# EAGLE design Sensor tile (EAGLE 6.6.0)
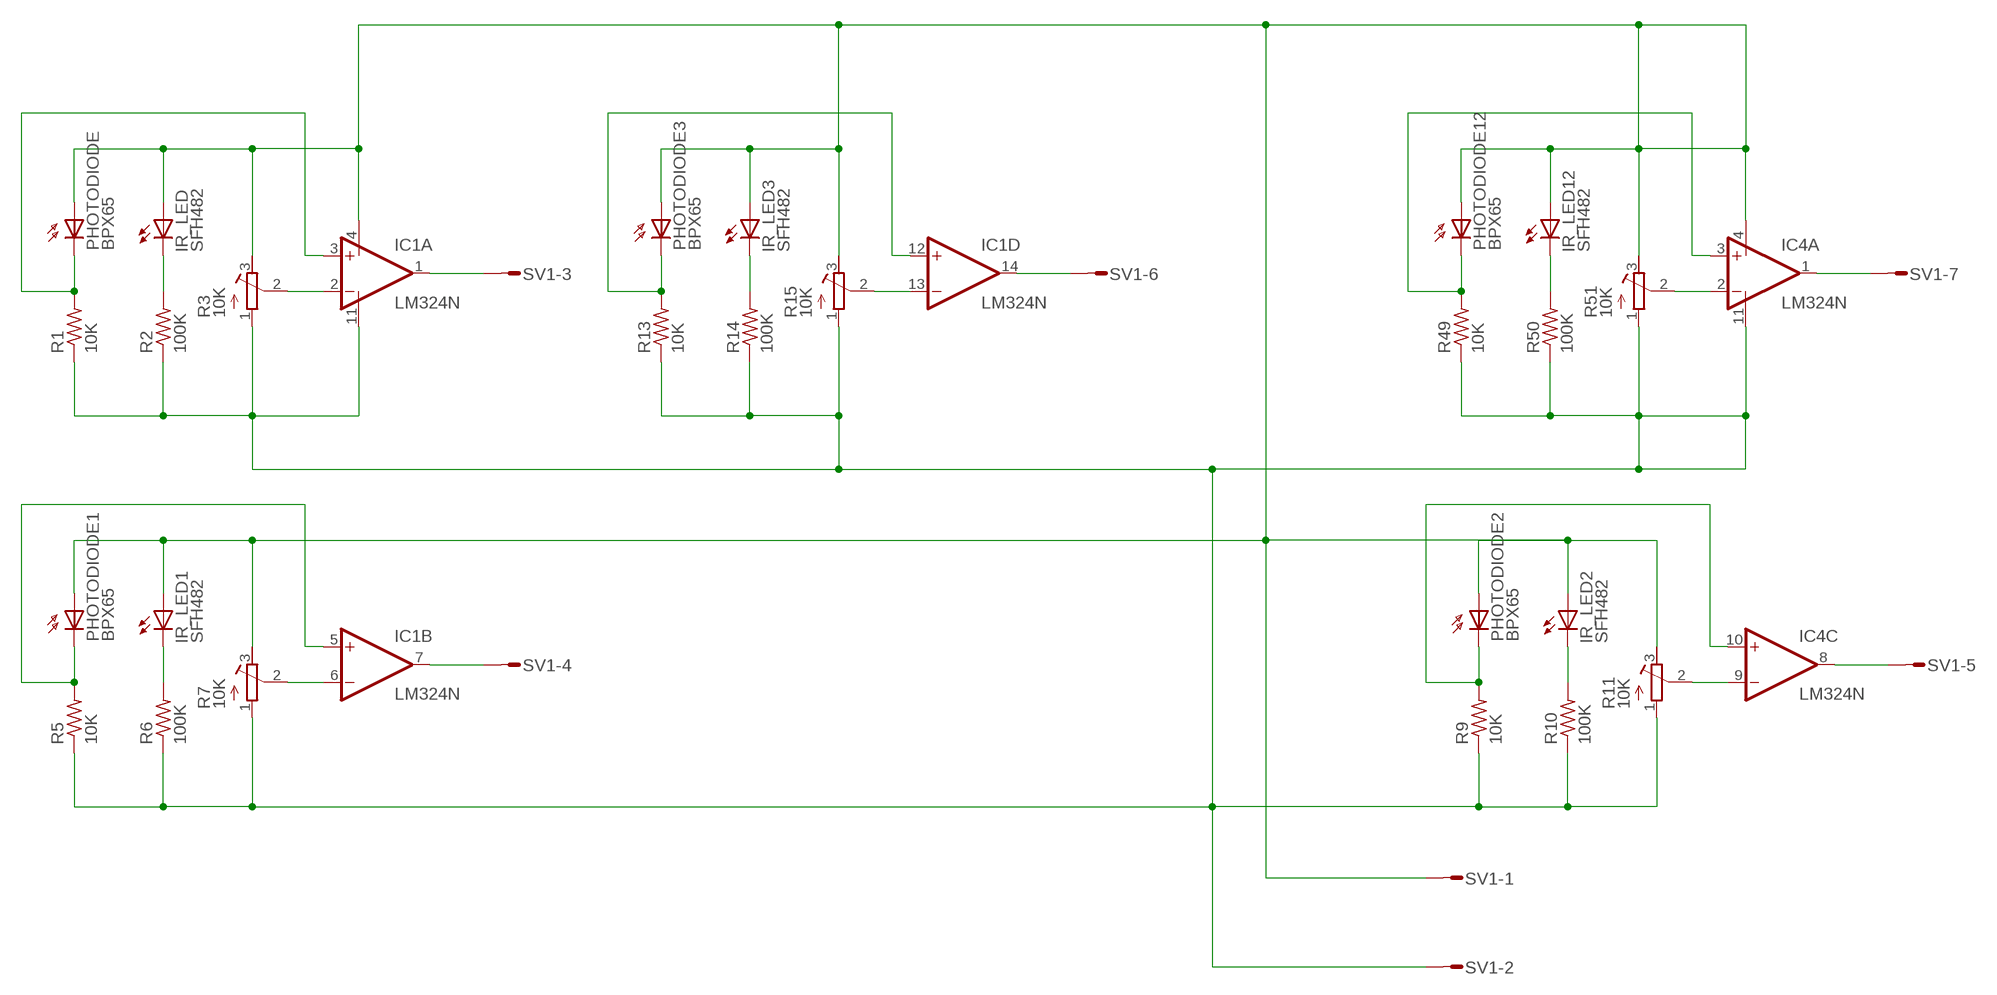
[diagram p0: schematic, sheet 1]

## Parts
IC1  LM324N  [DIL14]
IC4  LM324N  [DIL14]
IR_LED  SFH482  [SFH482]
IR_LED1  SFH482  [SFH482]
IR_LED2  SFH482  [SFH482]
IR_LED3  SFH482  [SFH482]
IR_LED12  SFH482  [SFH482]
PHOTODIODE  BPX65  [BPX65]
PHOTODIODE1  BPX65  [BPX65]
PHOTODIODE2  BPX65  [BPX65]
PHOTODIODE3  BPX65  [BPX65]
PHOTODIODE12  BPX65  [BPX65]
R1  10K  R-US_0204/7  [0204/7]
R2  100K  R-US_0204/7  [0204/7]
R3  10K  R-TRIMM4G/J  [RTRIM4G/J]
R5  10K  R-US_0204/7  [0204/7]
R6  100K  R-US_0204/7  [0204/7]
R7  10K  R-TRIMM4G/J  [RTRIM4G/J]
R9  10K  R-US_0204/7  [0204/7]
R10  100K  R-US_0204/7  [0204/7]
R11  10K  R-TRIMM4G/J  [RTRIM4G/J]
R13  10K  R-US_0204/7  [0204/7]
R14  100K  R-US_0204/7  [0204/7]
R15  10K  R-TRIMM4G/J  [RTRIM4G/J]
R49  10K  R-US_0204/7  [0204/7]
R50  100K  R-US_0204/7  [0204/7]
R51  10K  R-TRIMM4G/J  [RTRIM4G/J]
SV1  L07P  [L07P]

## Nets
N$2: IC1.3(A:+IN) PHOTODIODE.K(C) R1.2
N$3: IR_LED.K(C) R2.2
N$5: IC1.2(A:-IN) R3.2(S)
N$6: IC1.1(A:OUT) SV1.3
N$9: IC1.5(B:+IN) PHOTODIODE1.K(C) R5.2
N$10: IR_LED1.K(C) R6.2
N$12: IC1.6(B:-IN) R7.2(S)
N$14: IC1.7(B:OUT) SV1.4
N$15: IC1.4(P:V+) IC4.4(P:V+) IR_LED1.A IR_LED2.A IR_LED3.A IR_LED12.A IR_LED.A PHOTODIODE1.A PHOTODIODE2.A PHOTODIODE3.A PHOTODIODE12.A PHOTODIODE.A R3.3(E) R7.3(E) R11.3(E) R15.3(E) R51.3(E) SV1.1
N$16: IC4.10(C:+IN) PHOTODIODE2.K(C) R9.2
N$17: IR_LED2.K(C) R10.2
N$18: IC1.11(P:V-) IC4.11(P:V-) R1.1 R2.1 R3.1(A) R5.1 R6.1 R7.1(A) R9.1 R10.1 R11.1(A) R13.1 R14.1 R15.1(A) R49.1 R50.1 R51.1(A) SV1.2
N$19: IC4.9(C:-IN) R11.2(S)
N$21: IC4.8(C:OUT) SV1.5
N$23: IC1.12(D:+IN) PHOTODIODE3.K(C) R13.2
N$24: IR_LED3.K(C) R14.2
N$26: IC1.13(D:-IN) R15.2(S)
N$28: IC1.14(D:OUT) SV1.6
N$57: IC4.3(A:+IN) PHOTODIODE12.K(C) R49.2
N$60: IR_LED12.K(C) R50.2
N$85: IC4.2(A:-IN) R51.2(S)
N$87: IC4.1(A:OUT) SV1.7
Unconnected: IC1.8(C:OUT) IC1.9(C:-IN) IC1.10(C:+IN) IC4.5(B:+IN) IC4.6(B:-IN) IC4.7(B:OUT) IC4.12(D:+IN) IC4.13(D:-IN) IC4.14(D:OUT)

## Library data of the parts
IC1 IC4 = linear:LM324: OP AMP
IR_LED IR_LED1-IR_LED3 IR_LED12 = led:SFH482: IR LED infrared emitting diode, Infineon
PHOTODIODE PHOTODIODE1-PHOTODIODE3 PHOTODIODE12 = opto-trans-siemens:BPX65: PHOTO DIODE; MPN: BPX65.; OC_FARNELL: 327451; OC_NEWARK: 06WX2764
R1 R2 R5 R6 R9 R10 R13 R14 R49 R50 = rcl:R-US_: RESISTOR, American symbol
R3 R7 R11 R15 R51 = rcl:R-TRIMM: Trimm resistor
SV1 = con-amp-mt:L07P: AMP MT CONNECTOR; OC_FARNELL: unknown; OC_NEWARK: unknown

## Net classes
0 default: clearance 0.205 mm

## Board
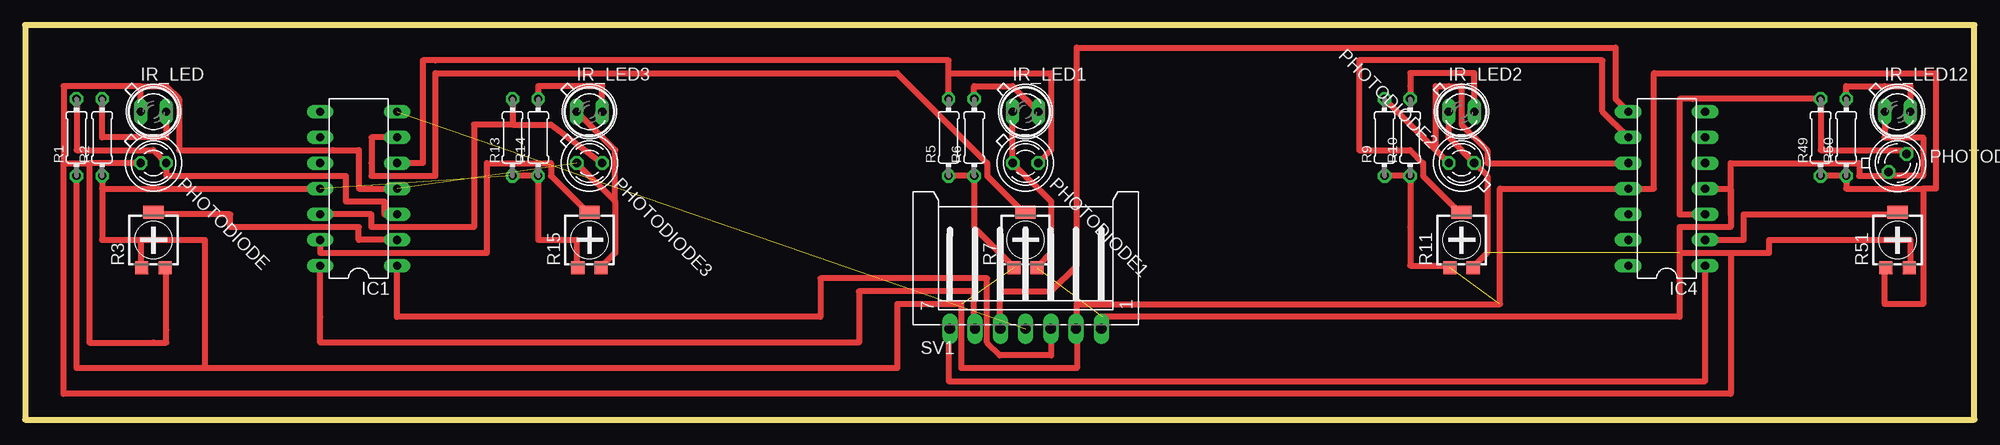
[diagram p1: board, top side]

Size 193.02 x 39.04 mm. Coordinates in mm from the lower left corner, seen from the top.
Outline: 0,0 193.02,0 193.02,39.04 0,39.04 0,0
Copper layers (1*16): Top 0.035mm / dielectric 1.5mm / Bottom 0.035mm
Design rules "default": minimum track width 10mil, minimum drill 24mil, track to track 8mil, track to pad 8mil, pad to pad 8mil, via to via 8mil, smd to smd 8mil, copper to edge 40mil, drill to drill 8mil, minimum pad ring 10mil, minimum via ring 8mil, stop-mask expansion 4mil, vias tented up to drill 0mil, thermal gap 10mil

### Footprints (pad centres in the part's own frame; a part is rotated, then mirrored left to right if it is on the bottom)
DIL14 = drill 0.813 long: 1 -7.62,-3.81; 2 -5.08,-3.81; 3 -2.54,-3.81; 4 0,-3.81; 5 2.54,-3.81; 6 5.08,-3.81; 7 7.62,-3.81; 8 7.62,3.81; 9 5.08,3.81; 10 2.54,3.81; 11 0,3.81; 12 -2.54,3.81; 13 -5.08,3.81; 14 -7.62,3.81
SFH482 = drill 0.813 long: A -1.27,0; K 1.27,0
BPX65 = drill 0.813 octagon: A -0.889,-0.889; K 0.889,0.889
0204/7 = drill 0.813 octagon: 1 -3.81,0; 2 3.81,0
RTRIM4G/J = smd 1.3 x 1.3: 1 -1.15,-2.75; 3 1.15,-2.75 | smd 2 x 1.3: 2 0,2.75
L07P = drill 1.016 long: 1 7.5,-6.25; 2 5,-6.25; 3 2.5,-6.25; 4 0,-6.25; 5 -2.5,-6.25; 6 -5,-6.25; 7 -7.5,-6.25

### Placement (x,y rotation side)
IC1  33.02,22.86 90 top
IC4  162.56,22.86 90 top
IR_LED  12.7,30.48 0 top
IR_LED1  99.06,30.48 0 top
IR_LED2  142.24,30.48 0 top
IR_LED3  55.88,30.48 0 top
IR_LED12  185.42,30.48 0 top
PHOTODIODE  12.7,25.4 315 top
PHOTODIODE1  99.06,25.4 315 top
PHOTODIODE2  142.24,25.4 135 top
PHOTODIODE3  55.88,25.4 315 top
PHOTODIODE12  185.42,25.4 0 top
R1  5.08,27.94 90 top
R2  7.62,27.94 90 top
R3  12.7,17.78 0 top
R5  91.44,27.94 90 top
R6  93.98,27.94 90 top
R7  99.06,17.78 0 top
R9  134.62,27.94 90 top
R10  137.16,27.94 90 top
R11  142.24,17.78 0 top
R13  48.26,27.94 90 top
R14  50.8,27.94 90 top
R15  55.88,17.78 0 top
R49  177.8,27.94 90 top
R50  180.34,27.94 90 top
R51  185.42,17.78 0 top
SV1  99.06,15.24 0 top

### Tracks (layer width: path | path; a pad name or v marks a point on that pad's centre or on a via)
N$2
  Top 0.61: PHOTODIODE.K 12.7,26.67 5.08,26.67 R1.2 | IC1.3 35.56,20.32 35.56,21.59 31.75,21.59 31.75,24.13 13.97,24.13 PHOTODIODE.K | PHOTODIODE.K
N$3
  Top 0.61: R2.2 7.62,27.94 13.97,27.94 IR_LED.K
N$5
  Top 0.61: IC1.2 33.02,17.78 33.02,19.05 20.32,19.05 20.32,20.32 12.7,20.32 R3.2
N$6
  Top 0.61: IC1.1 36.83,10.16 78.74,10.16 78.74,13.97 95.25,13.97 95.25,7.62 96.52,6.35 101.6,6.35 101.6,8.89 SV1.3
N$9
  Top 0.61: IC1.5 39.37,25.4 39.37,27.94 39.37,34.29 39.37,35.56 40.64,35.56 91.44,35.56 91.44,34.29 | R5.2 91.44,34.29 | 91.44,34.29 99.06,34.29 101.6,34.29 101.6,33.02 101.6,31.75 101.6,26.67 PHOTODIODE1.K
N$10
  Top 0.61: IR_LED1.K 97.79,33.02 93.98,33.02 R6.2
N$12
  Top 0.61: IC1.6 34.29,27.94 34.29,25.4 34.29,24.13 38.1,24.13 40.64,24.13 40.64,26.67 40.64,34.29 86.36,34.29 95.25,25.4 95.25,24.13 99.06,20.32 R7.2
N$14  (1 unrouted)
N$15  (3 unrouted)
  Top 0.61: PHOTODIODE2.A 144.78,24.13 144.78,16.51 143.51,15.24 R11.3 | IR_LED2.A 140.97,27.94 PHOTODIODE2.A | PHOTODIODE2.A | PHOTODIODE1.A 101.6,21.59 101.6,16.51 100.33,15.24 R7.3 | PHOTODIODE1.A IR_LED1.A | PHOTODIODE1.A | 58.42,21.59 58.42,16.51 57.15,15.24 R15.3 | 58.42,21.59 PHOTODIODE3.A | IR_LED3.A 58.42,26.67 58.42,21.59 | 6.35,25.4 6.35,7.62 12.7,7.62 13.97,7.62 13.97,8.89 13.97,15.24 R3.3 | PHOTODIODE.A 6.35,25.4 | IC1.4 34.29,22.86 33.02,22.86 33.02,24.13 33.02,26.67 30.48,26.67 15.24,26.67 15.24,31.75 13.97,33.02 11.43,33.02 | IR_LED.A 11.43,33.02 | 3.81,25.4 3.81,33.02 11.43,33.02 | 184.15,24.13 187.96,24.13 187.96,26.67 187.96,27.94 184.15,27.94 IR_LED12.A | 163.83,16.51 168.91,16.51 | 168.91,16.51 172.72,16.51 172.72,17.78 186.69,17.78 186.69,15.24 R51.3 | 163.83,16.51 163.83,17.78 163.83,19.05 165.1,19.05 168.91,19.05 168.91,20.32 | IC4.4 168.91,22.86 168.91,20.32 | 163.83,16.51 163.83,10.16 106.68,10.16 SV1.1 | 184.15,24.13 181.61,24.13 181.61,25.4 168.91,25.4 168.91,20.32 | 184.15,24.13 PHOTODIODE12.A | 3.81,25.4 6.35,25.4 | 3.81,25.4 3.81,2.54 168.91,2.54 168.91,16.51
N$16
  Top 0.61: R9.2 139.7,26.67 | 139.7,26.67 PHOTODIODE2.K | IC4.10 144.78,25.4 144.78,26.67 142.24,29.21 142.24,31.75 142.24,33.02 140.97,33.02 139.7,33.02 139.7,26.67
N$17
  Top 0.61: R10.2 137.16,33.02 137.16,34.29 139.7,34.29 143.51,34.29 IR_LED2.K
N$18  (3 unrouted)
  Top 0.61: R11.1 140.97,15.24 137.16,15.24 137.16,19.05 R10.1 R9.1 | R7.1 97.79,15.24 93.98,19.05 R6.1 R5.1 | R15.1 54.61,15.24 54.61,17.78 50.8,17.78 50.8,19.05 R14.1 R13.1 | 11.43,17.78 7.62,17.78 7.62,22.86 | 11.43,17.78 11.43,15.24 R3.1 | R2.1 7.62,22.86 | 7.62,22.86 IC1.11 | R1.1 5.08,5.08 17.78,5.08 | 17.78,5.08 17.78,16.51 17.78,17.78 11.43,17.78 | 187.96,22.86 187.96,11.43 184.15,11.43 184.15,15.24 R51.1 | 187.96,22.86 180.34,22.86 R50.1 R49.1 | 187.96,22.86 189.23,22.86 189.23,34.29 161.29,34.29 161.29,22.86 IC4.11 146.05,22.86 146.05,11.43 104.14,11.43 104.14,10.16 SV1.2 104.14,8.89 104.14,5.08 92.71,5.08 92.71,11.43 86.36,11.43 86.36,5.08 17.78,5.08
N$19
  Top 0.61: IC4.9 156.21,30.48 156.21,35.56 132.08,35.56 132.08,26.67 137.16,26.67 138.43,25.4 138.43,24.13 142.24,20.32 R11.2
N$21
  Top 0.61: IC4.8 157.48,31.75 157.48,36.83 104.14,36.83 104.14,15.24 101.6,12.7 96.52,12.7 96.52,8.89 SV1.5
N$23
  Top 0.61: IC1.12 34.29,20.32 34.29,19.05 44.45,19.05 44.45,29.21 48.26,29.21 | R13.2 48.26,29.21 | 48.26,29.21 52.07,29.21 PHOTODIODE3.K
N$24
  Top 0.61: R14.2 50.8,33.02 57.15,33.02 IR_LED3.K
N$26
  Top 0.61: IC1.13 29.21,16.51 43.18,16.51 45.72,16.51 45.72,19.05 45.72,25.4 52.07,25.4 52.07,24.13 55.88,20.32 R15.2
N$28
  Top 0.61: IC1.14 29.21,10.16 29.21,7.62 31.75,7.62 82.55,7.62 82.55,12.7 93.98,12.7 93.98,10.16 SV1.6
N$57
  Top 0.61: IC4.3 163.83,20.32 163.83,22.86 163.83,30.48 163.83,31.75 165.1,31.75 R49.2 177.8,26.67 186.69,26.67 PHOTODIODE12.K
N$60
  Top 0.61: IR_LED12.K 186.69,33.02 184.15,33.02 180.34,33.02 R50.2
N$85
  Top 0.61: IC4.2 168.91,17.78 170.18,17.78 170.18,19.05 170.18,20.32 185.42,20.32 R51.2
N$87
  Top 0.61: IC4.1 166.37,3.81 91.44,3.81 91.44,8.89 SV1.7